# Altium schematic sheet FTDI.SchDoc
size B
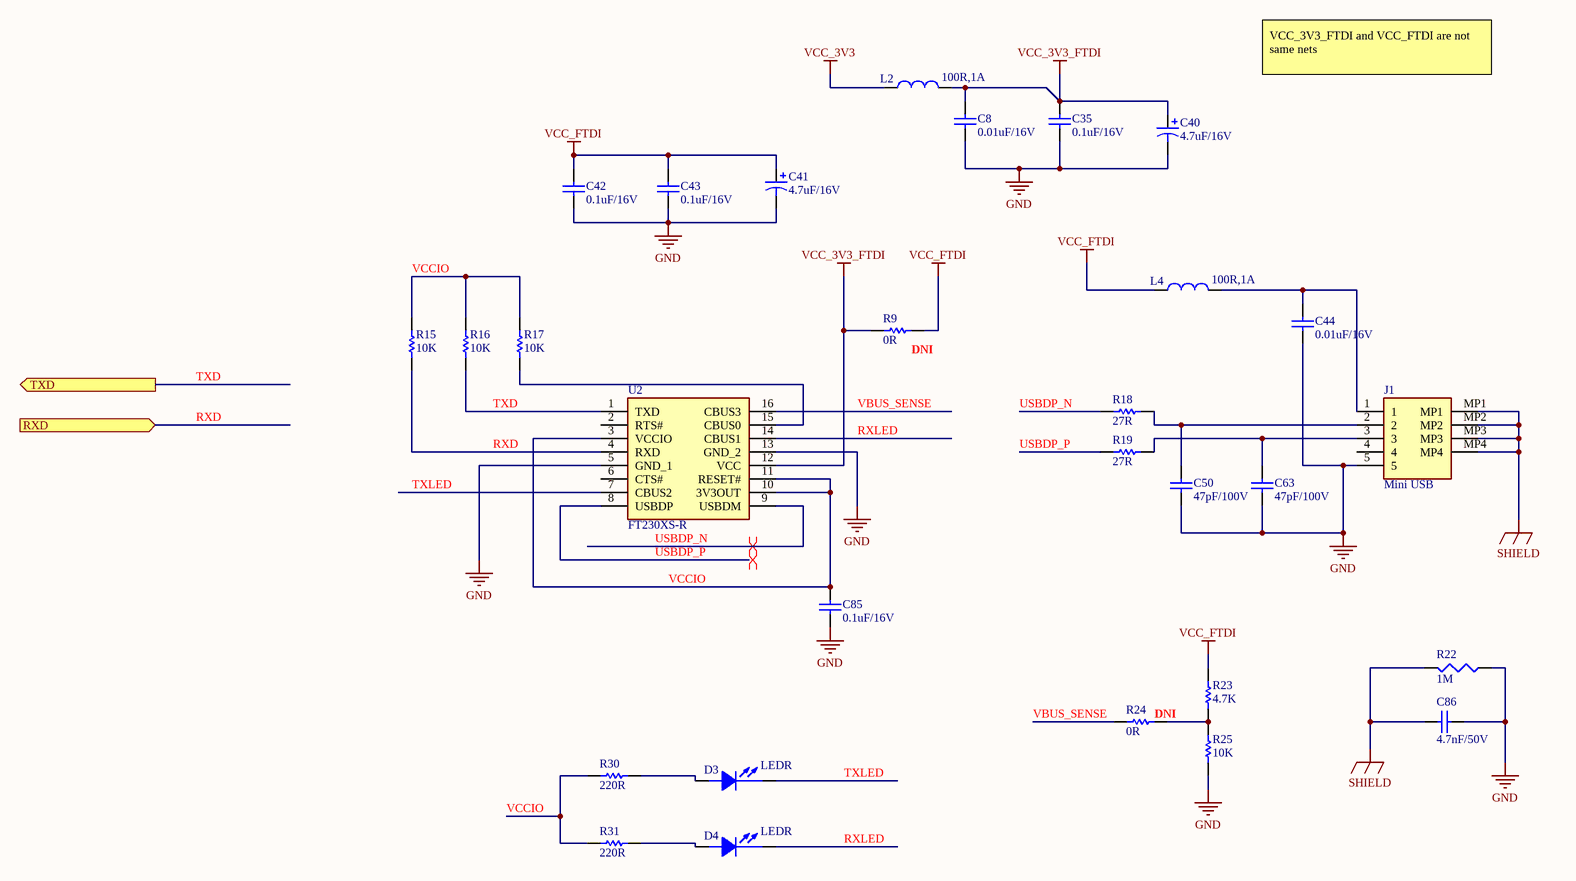
[diagram p0: FTDI.SchDoc]

## Parts
C8  0.01uF/16V  [0603C]
C35  0.1uF/16V  [0603C]
C40  4.7uF/16V  [CASE-A]
C41  4.7uF/16V  [CASE-A]
C42  0.1uF/16V  [0603C]
C43  0.1uF/16V  [0603C]
C44  0.01uF/16V  [0603C]
C50  47pF/100V  [0603C]
C63  47pF/100V  [0603C]
C85  0.1uF/16V  [0603C]
C86  4.7nF/50V  [0603C]
D3  LEDR  [LED_0603]
D4  LEDR  [LED_0603]
J1  Mini USB  [10033527-N3112LF]
L2  100R,1A  [0603L]
L4  100R,1A  [0603L]
R9  0R  [0603R]
R15  10K  [0603R]
R16  10K  [0603R]
R17  10K  [0603R]
R18  27R  [0603R]
R19  27R  [0603R]
R22  1M  [0805R]
R23  4.7K  [0603R]
R24  0R  [0603R]
R25  10K  [0603R]
R30  220R  [0603R]
R31  220R  [0603R]
U2  FT230XS-R  [FT230]

## Ports
RXD (in), TXD (out)

## Nets
GND: C8.2 C35.2 C40.2 C41.2 C42.1 C43.1 C44.2 C50.1 C63.1 C85.1 C86.1 J1.5 R22.2 R25.2 U2.5(GND_1) U2.13(GND_2)
SHIELD: C86.2 J1.MP1 J1.MP2 J1.MP3 J1.MP4 R22.1
VCC_3V3: L2.1
VCC_3V3_FTDI: C8.1 C35.1 C40.1 L2.2 R9.1 U2.12(VCC)
VCC_FTDI: C41.1 C42.2 C43.2 L4.1 R9.2 R23.2
RXD: R15.2 U2.4(RXD) ; port RXD
RXLED: D4.2(CATHODE) U2.14(CBUS1)
TXD: R16.2 U2.1(TXD) ; port TXD
TXLED: D3.2(CATHODE) U2.7(CBUS2)
USBDP_N: R18.2 U2.9(USBDM)
USBDP_P: R19.2 U2.8(USBDP)
VBUS_SENSE: R24.1 U2.16(CBUS3)
VCCIO: C85.2 R15.1 R16.1 R17.1 R30.2 R31.2 U2.3(VCCIO) U2.10(3V3OUT) U2.11(RESET#)
NetC44_1: C44.1 J1.1 L4.2
NetC50_2: C50.2 J1.2 R18.1
NetC63_2: C63.2 J1.3 R19.1
NetD3_1: D3.1(ANODE) R30.1
NetD4_1: D4.1(ANODE) R31.1
NetR17_2: R17.2 U2.15(CBUS0)
NetR23_1: R23.1 R24.2 R25.1

Not connected (* = marked no-connect by the designer): J1 4; U2 2(RTS#) 6(CTS#)

## Layout directives
differential pair: USBDP_N, USBDP_P

## Notes on the sheet
- VCC_3V3_FTDI and VCC_FTDI are not same nets
- (near R9) DNI
- (near R24) DNI

## Library data of the parts
C8 C44 = Cap: Multilayer Ceramic Capacitors MLCC - SMD/SMT 16V 0.01uF X7R 0603 10% AEC-Q200; Mfr: KEMET; Mfr Part No: C0603C103K4RECAUTO; Package: 0603; Price: 0.151; Stockiest: MOUSER; Stockiest Part No: 80-C0603C103K4RECAUT; Value: 0.01uF/16V
C35 = Cap: Multilayer Ceramic Capacitors MLCC - SMD/SMT 0603 16VDC 0.1uF 10% X7R AEC-Q200; Mfr: Taiyo Yuden; Mfr Part No: EMK107B7104KAHT; Package: 0603; Price: 0.101; Stockiest: MOUSER; Stockiest Part No: 963-EMK107B7104KAHT; Value: 0.1uF/16V
C40 C41 = Cap Pol1: Tantalum Capacitors - Solid SMD 16V 4.7uF 1206; Mfr: KEMET; Mfr Part No: T495A475K016ATA2K0; Value: 4.7uF/16V; Package: 1206; Price: 1.83; Stockiest: MOUSER; Stockiest Part No: 80-T495A475K16ATA2K0
C42 C43 C85 = Cap: Multilayer Ceramic Capacitors MLCC - SMD/SMT 0603 16VDC 0.1uF 10% X7R AEC-Q2000; Mfr: Taiyo Yuden; Mfr Part No: EMK107B7104KAHT; Value: 0.1uF/16V; Package: 0603; Price: 0.101; Stockiest: MOUSER; Stockiest Part No: 963-EMK107B7104KAHT
C50 C63 = Cap: Multilayer Ceramic Capacitors MLCC - SMD/SMT 100V 47pF 0603 X8R 20% AEC-Q200; Mfr: KEMET; Mfr Part No: C0603C470M1HACAUTO; Value: 47pF/100V; Package: 0603; Price: 0.121; Stockiest: MOUSER; Stockiest Part No: 80-C0603C470M1HAUTO
C86 = 0805_CAP: Multilayer Ceramic Capacitors MLCC - SMD/SMT 50V 4700pF X7R 0603 10% AEC-Q200; Mfr Part No: C0603C472K5RACAUTO7411; Mfr: KEMET; Price: 0.221; Stockiest: MOUSER; Stockiest Part No: 80-C0603C472K5RAUTLR; Value: 4.7nF/50V; Package: 0603
D3 D4 = LED: Standard LEDs - SMD Red 631nm 14mcd 5mA; Mfr Part No: LTST-C193KRKT-5A; Mfr: Lite On; Package: 0603; Price: 0.28; Stockiest Part No: 859-LTSTC193KRKT5A; Value: RED; Stockiest: MOUSER
J1 = 10033527-N3112LF: USB Connectors M-USB 1X1 B/REC R/A SMT; Mfr: TE Connectivity; Mfr Part No: 1734035-2; Price: 1.59; Stockiest: MOUSER; Stockiest Part No: 571-1734035-2
L2 L4 = 0805_IND: Ferrite Beads 100ohms 1A 60mOhms 0603 Ferrite Chip; Mfr: TDK; Mfr Part No: MPZ1608D101BTA00; Value: 100R/1A; Package: 0603; Price: 0.10; Stockiest: MOUSER; Stockiest Part No: 810-MPZ1608D101BTA00
R9 R24 = Res1: Thick Film Resistors - SMD 1/10Watt 0ohms Commercial Use; Mfr: Vishay / Dale; Mfr Part No: CRCW06030000Z0EAC; Value: 0R; Package: 0603; Price: 0.101; Stockiest: MOUSER; Stockiest Part No: 71-CRCW06030000Z0EAC
R15-R17 R25 = Res1: Thick Film Resistors - SMD 0603 10Kohms 1% Anti-Sulfur AEC-Q200; Mfr: ROHM Semiconductor; Mfr Part No: SFR03EZPF1002; Value: 10K; Package: 0603; Price: 0.101; Stockiest: MOUSER; Stockiest Part No: 755-SFR03EZPF1002
R18 R19 = Res1: Thick Film Resistors - SMD 0603 0.25W 1% 27ohm AEC-Q200; Mfr: Panasonic; Mfr Part No: ERJ-UP3F27R0V; Value: 27R; Package: 0603; Price: 0.262; Stockiest: MOUSER; Stockiest Part No: 667-ERJ-UP3F27R0V
R22 = 0805_RES: Thick Film Resistors - SMD 0603 0.25W 1% 1Mohm AEC-Q200; Mfr Part No: ERJ-UP3F1004V; Mfr: Panasonic; Price: 0.262; Stockiest: MOUSER; Stockiest Part No: 667-ERJ-UP3F1004V; Value: 1M; Package: 0603
R23 = Res1: Thick Film Resistors - SMD 1/10Watt 4.7Kohms 5% Commercial Use; Mfr: Vishay / Dale; Mfr Part No: CRCW06034K70JNEAC; Package: 0603; Price: 0.101; Stockiest: MOUSER; Stockiest Part No: 71-CRCW06034K70JNEAC; Value: 4.7K
R30 R31 = Res1: Thick Film Resistors - SMD 1/10Watt 220ohms 5% Commercial Use; Mfr: Vishay / Dale; Mfr Part No: CRCW0603220RJNEAC; Package: 0603; Price: 0.101; Stockiest: MOUSER; Stockiest Part No: 71-CRCW0603220RJNEAC; Value: 220R
U2 = FT230: USB Interface IC USB to Basic Serial UART IC SSOP-16; Mfr: FTDI; Mfr Part No: FT230XS-R; Price: 2.06; Stockiest: MOUSER; Stockiest Part No: 895-FT230XS-R